# Altium project 主机.PrjPcb
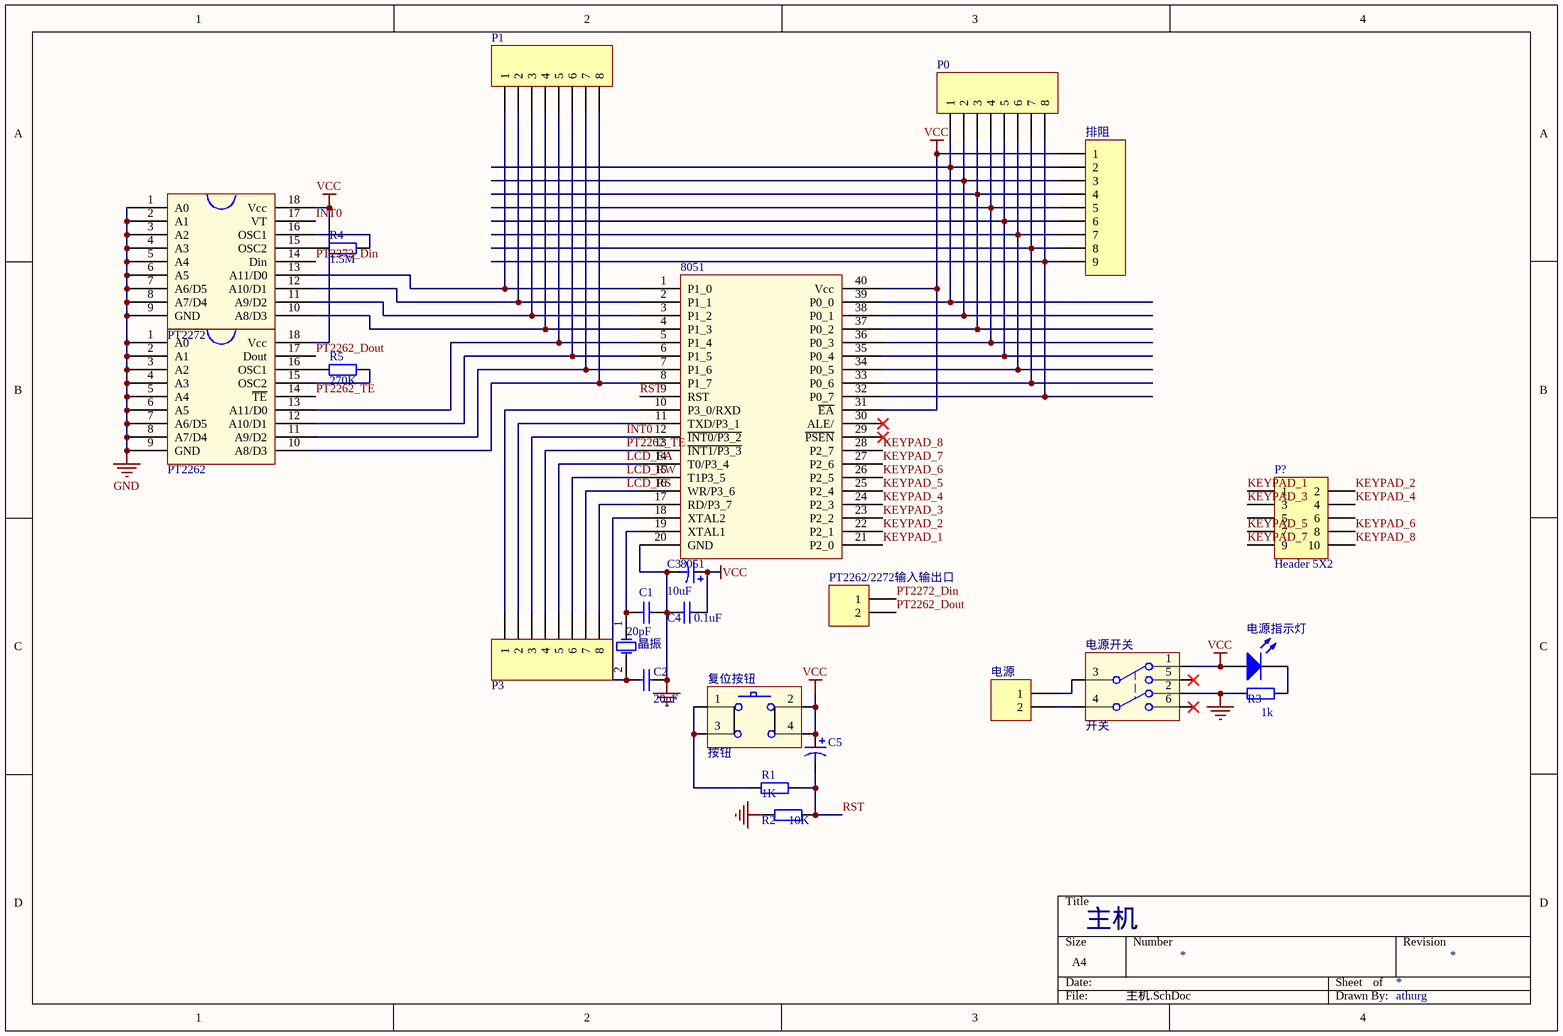
[diagram p0: 主机.SchDoc]
1 sheet, 24 parts. Net scope: global (net labels, ports and power ports of the same name join across sheets).
Board file: 主机.PcbDoc

## Sheet 主机.SchDoc: 主机
size A4; DrawnBy: athurg

### Parts
8051  8051  [DIP-40]
C1  value 20pF  [RAD-0.2]  (hidden comment: Cap)
C2  value 20pF  [rad-0.2]  (hidden comment: Cap)
C3  value 10uF  [C1206]  (hidden comment: Cap Pol1)
C4  value 0.1uF  [C0805]  (hidden comment: Cap)
C5  Cap Pol1  [C1206]  (value not drawn)
P0  Header 8  [HDR1X8]  (value not drawn)
P1  Header 8  [HDR1X8]  (value not drawn)
P3  Header 8  [HDR1X8]  (value not drawn)
P?  Header 5X2  [HDR2X5]
PT2262  2262  [DIP-18]  (value not drawn)
PT2262/2272输入输出口  (no value)  [HDR1X2]
PT2272  2272  [DIP-18]  (value not drawn)
R1  value 1K  [C0805]  (hidden comment: Res2)
R2  value 10K  [C0805]  (hidden comment: Res2)
R3  value 1k  [C0805]  (hidden comment: Res2)
R4  value 1.5M  [C0805]  (hidden comment: Res2)
R5  value 270K  [C0805]  (hidden comment: Res2)
复位按钮  按钮  [按钮]
排阻  Header 9  [HDR1X9]  (value not drawn)
晶振  XTAL  [RAD-0.2]  (value not drawn)
电源  传感器接口  [HDR1X2]  (value not drawn)
电源开关  开关  [开关]
电源指示灯  LED0  [HDR1X2]  (value not drawn)

### Nets
GND: 8051.20(GND) C1.1 C2.1 C3.2 C4.1 PT2262.1(A0) PT2262.2(A1) PT2262.3(A2) PT2262.4(A3) PT2262.5(A4) PT2262.6(A5) PT2262.7(A6/D5) PT2262.8(A7/D4) PT2262.9(GND) PT2272.1(A0) PT2272.2(A1) PT2272.3(A2) PT2272.4(A3) PT2272.5(A4) PT2272.6(A5) PT2272.7(A6/D5) PT2272.8(A7/D4) PT2272.9(GND) R2.2 R3.1 电源开关.2
VCC: 8051.31(~{EA}) 8051.40(Vcc) C3.1 C4.2 C5.1 PT2262.18(Vcc) PT2272.18(Vcc) 复位按钮.2 复位按钮.4 排阻.1 电源开关.1 电源指示灯.1(A)
INT0: 8051.12(~{INT0/P3_2}) P3.3 PT2272.17(VT)
KEYPAD_1: 8051.21(P2_0) P?.1
KEYPAD_2: 8051.22(P2_1) P?.2
KEYPAD_3: 8051.23(P2_2) P?.3
KEYPAD_4: 8051.24(P2_3) P?.4
KEYPAD_5: 8051.25(P2_4) P?.7
KEYPAD_6: 8051.26(P2_5) P?.8
KEYPAD_7: 8051.27(P2_6) P?.9
KEYPAD_8: 8051.28(P2_7) P?.10
LCD_EA: 8051.14(T0/P3_4) P3.5
LCD_RS: 8051.16(WR/P3_6) P3.7
LCD_RW: 8051.15(T1P3_5) P3.6
PT2262_Dout: PT2262.17(Dout) PT2262/2272输入输出口.2
PT2262_TE: 8051.13(~{INT1/P3_3}) P3.4 PT2262.14(~{TE})
PT2272_Din: PT2262/2272输入输出口.1 PT2272.14(Din)
RST: 8051.9(RST) C5.2 R1.1 R2.1
Net8051_1: 8051.1(P1_0) P1.1 PT2272.13(A11/D0)
Net8051_2: 8051.2(P1_1) P1.2 PT2272.12(A10/D1)
Net8051_3: 8051.3(P1_2) P1.3 PT2272.11(A9/D2)
Net8051_4: 8051.4(P1_3) P1.4 PT2272.10(A8/D3)
Net8051_5: 8051.5(P1_4) P1.5 PT2262.13(A11/D0)
Net8051_6: 8051.6(P1_5) P1.6 PT2262.12(A10/D1)
Net8051_7: 8051.7(P1_6) P1.7 PT2262.11(A9/D2)
Net8051_8: 8051.8(P1_7) P1.8 PT2262.10(A8/D3)
Net8051_10: 8051.10(P3_0/RXD) P3.1
Net8051_11: 8051.11(TXD/P3_1) P3.2
Net8051_17: 8051.17(RD/P3_7) P3.8
Net8051_18: 8051.18(XTAL2) C2.2 晶振.2(OSC2)
Net8051_19: 8051.19(XTAL1) C1.2 晶振.1(OSC1)
Net8051_32: 8051.32(P0_7) P0.8 排阻.9
Net8051_33: 8051.33(P0_6) P0.7 排阻.8
Net8051_34: 8051.34(P0_5) P0.6 排阻.7
Net8051_35: 8051.35(P0_4) P0.5 排阻.6
Net8051_36: 8051.36(P0_3) P0.4 排阻.5
Net8051_37: 8051.37(P0_2) P0.3 排阻.4
Net8051_38: 8051.38(P0_1) P0.2 排阻.3
Net8051_39: 8051.39(P0_0) P0.1 排阻.2
NetPT2262_15: PT2262.15(OSC2) R5.2
NetPT2262_16: PT2262.16(OSC1) R5.1
NetPT2272_15: PT2272.15(OSC2) R4.1
NetPT2272_16: PT2272.16(OSC1) R4.2
NetR1_2: R1.2 复位按钮.1 复位按钮.3
NetR3_2: R3.2 电源指示灯.2(K)
Net电源_1: 电源.1 电源开关.3
Net电源_2: 电源.2 电源开关.4

Not connected (* = marked no-connect by the designer): 8051 29(~{PSEN})* 30(ALE/)*; P? 5 6; 电源开关 5* 6*

### Library data of the parts
C1 C2 C4 = Cap: Capacitor; Published: 8-Jun-2000; LatestRevisionDate: 17-Jul-2002; LatestRevisionNote: Re-released for DXP Platform.; PackageReference: RAD-0.3; Publisher: Altium Limited
C3 C5 = Cap Pol1: Polarized Capacitor (Radial); Published: 8-Jun-2000; LatestRevisionDate: 17-Jul-2002; LatestRevisionNote: Re-released for DXP Platform.; PackageReference: RB7.6-15; Publisher: Altium Limited
P0 P1 P3 = Header 8: Header, 8-Pin; LatestRevisionDate: 17-Jul-2002; LatestRevisionNote: Re-released for DXP Platform.; Publisher: Altium Limited
P? = Header 5X2: Header, 5-Pin, Dual row; LatestRevisionDate: 17-Jul-2002; LatestRevisionNote: Re-released for DXP Platform.; Publisher: Altium Limited
PT2262/2272输入输出口 电源 = Header 2: Header, 2-Pin; LatestRevisionDate: 17-Jul-2002; LatestRevisionNote: Re-released for DXP Platform.; Publisher: Altium Limited
R1-R5 = Res2: Resistor; Published: 8-Jun-2000; LatestRevisionDate: 17-Jul-2002; LatestRevisionNote: Re-released for DXP Platform.; PackageReference: AXIAL-0.4; Publisher: Altium Limited
排阻 = Header 9: Header, 9-Pin; LatestRevisionDate: 17-Jul-2002; LatestRevisionNote: Re-released for DXP Platform.; Publisher: Altium Limited
晶振 = XTAL: Crystal Oscillator; Published: 8-Jun-2000; LatestRevisionDate: 17-Jul-2002; LatestRevisionNote: Re-released for DXP Platform.; PackageReference: R38; Publisher: Altium Limited
电源指示灯 = LED0: Typical INFRARED GaAs LED; Published: 8-Jun-2000; LatestRevisionDate: 08-Jul-2005; LatestRevisionNote: Mech Layer 1 removed.; PackageReference: LED-0; Publisher: Altium Limited